# Altium schematic sheet 09 MMC_UBOOT.SchDoc
size 420 x 297 mm
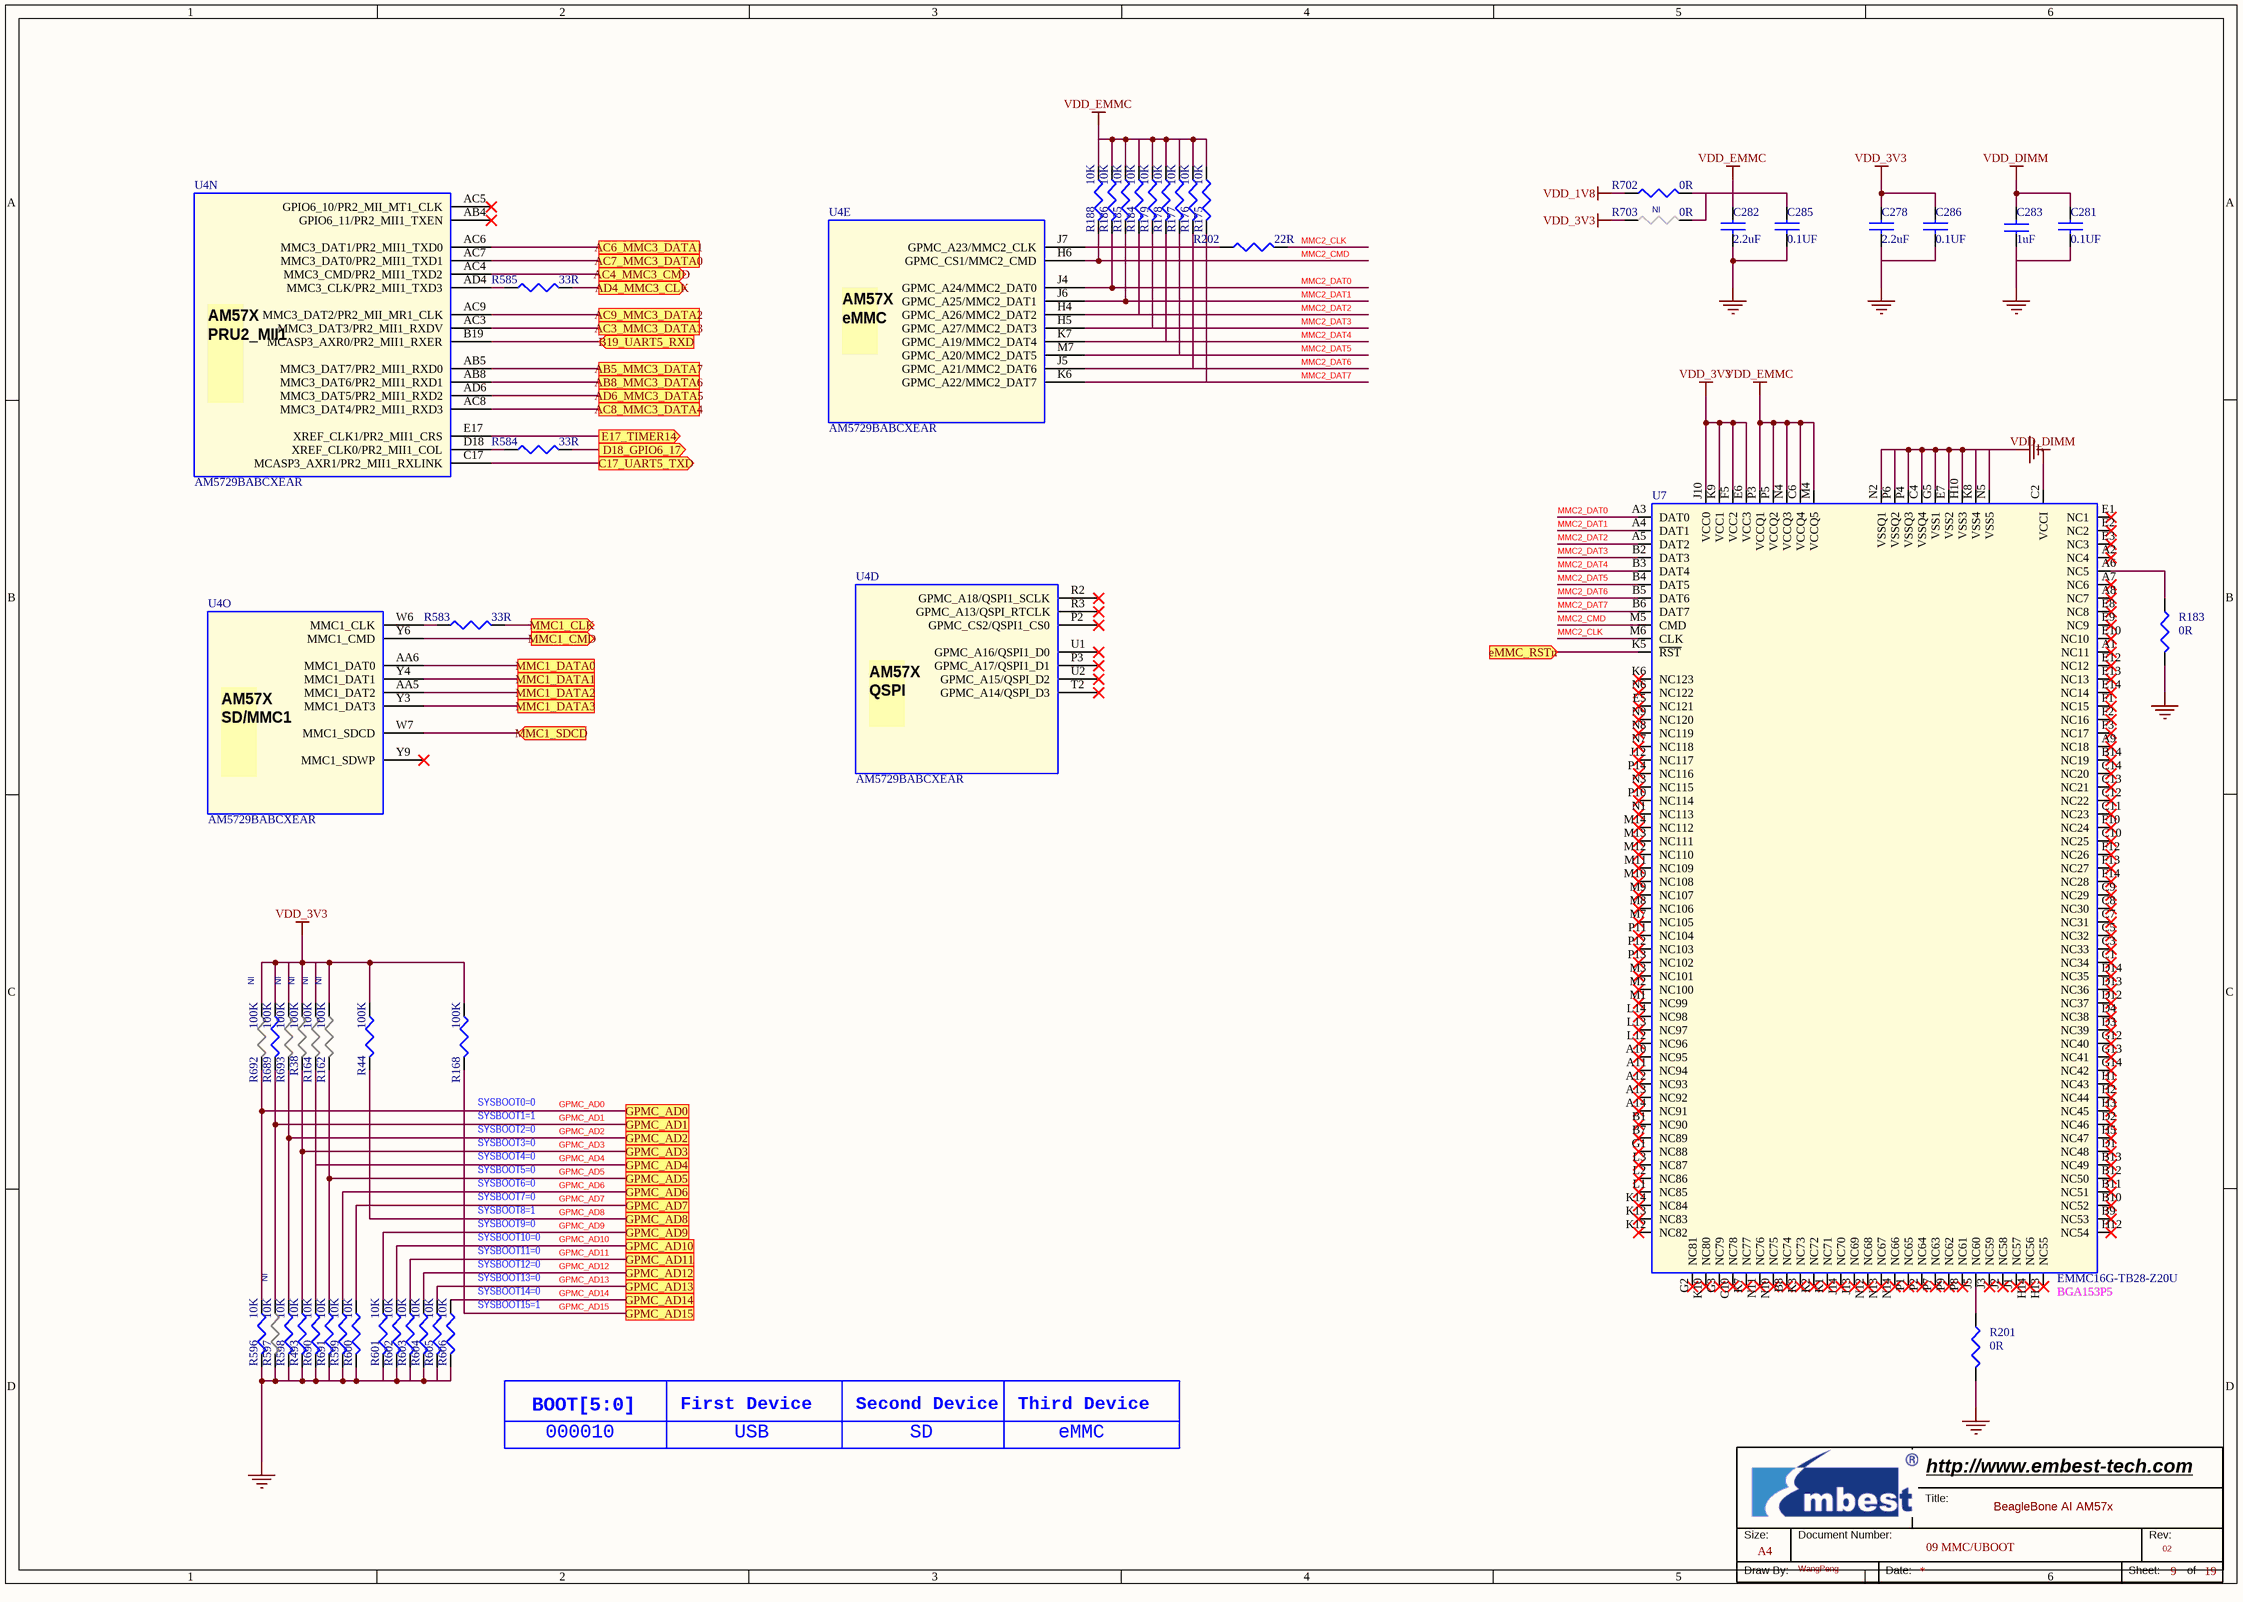
[diagram p0: 09 MMC_UBOOT.SchDoc]

## Parts
*  Page Count: 19  Page Number: 9  Page Size: A4  Title: BeagleBone AI AM57x  RevCode: 02  Doc: 09 MMC/UBOOT  Drawing: WangPeng  (hidden comment: Embest Title)  (graphical)
C278  2.2uF  [C0603]
C281  0.1UF  [C0402]
C282  2.2uF  [C0603]
C283  1uF  [C0402]
C285  0.1UF  [C0402]
C286  0.1UF  [C0402]
R38  100K  ASSY: NI  [R0402]
R44  100K  [R0402]
R162  100K  ASSY: NI  [R0402]
R164  100K  ASSY: NI  [R0402]
R168  100K  [R0402]
R175  10K  [R0402]
R176  10K  [R0402]
R177  10K  [R0402]
R178  10K  [R0402]
R179  10K  [R0402]
R183  0R  [R0402]
R184  10K  [R0402]
R185  10K  [R0402]
R186  10K  [R0402]
R188  10K  [R0402]
R201  0R  [R0402]
R202  22R  [R0402]
R493  10K  [R0402]
R583  33R  [R0402]
R584  33R  [R0402]
R585  33R  [R0402]
R596  10K  [R0402]
R597  10K  ASSY: NI  [R0402]
R598  10K  [R0402]
R599  10K  [R0402]
R600  10K  [R0402]
R601  10K  [R0402]
R602  10K  [R0402]
R603  10K  [R0402]
R604  10K  [R0402]
R605  10K  [R0402]
R606  10K  [R0402]
R689  100K  [R0402]
R690  10K  [R0402]
R691  10K  [R0402]
R692  100K  ASSY: NI  [R0402]
R693  100K  ASSY: NI  [R0402]
R702  0R  [R0402]
R703  0R  ASSY: NI  [R0402]
U4  AM5729BABCXEAR  [BGA23X23-760-117M]  (parts D,E,N,O of 29)
U7  EMMC16G-TB28-Z20U  [BGA153P5]

## Ports
AB5_MMC3_DATA7, AB8_MMC3_DATA6, AC3_MMC3_DATA3, AC4_MMC3_CMD (out), AC6_MMC3_DATA1, AC7_MMC3_DATA0, AC8_MMC3_DATA4, AC9_MMC3_DATA2, AD4_MMC3_CLK (out), AD6_MMC3_DATA5, B19_UART5_RXD (in), C17_UART5_TXD (out), D18_GPIO6_17 (out), E17_TIMER14 (out), eMMC_RSTn (in), GPMC_AD0, GPMC_AD1, GPMC_AD2, GPMC_AD3, GPMC_AD4, GPMC_AD5, GPMC_AD6, GPMC_AD7, GPMC_AD8, GPMC_AD9, GPMC_AD10, GPMC_AD11, GPMC_AD12, GPMC_AD13, GPMC_AD14, GPMC_AD15, MMC1_CLK (out), MMC1_CMD (out), MMC1_DATA0, MMC1_DATA1, MMC1_DATA2, MMC1_DATA3, MMC1_SDCD (in)

## Nets
GND: C278.2 C281.2 C282.2 C283.1 C285.2 C286.2 R183.2 R201.2 R493.2 R596.2 R597.2 R598.2 R599.2 R600.2 R601.2 R602.2 R603.2 R604.2 R605.2 R606.2 R690.2 R691.2 U7.C4(VSSQ4) U7.E7(VSS2) U7.G5(VSS1) U7.H10(VSS3) U7.K8(VSS4) U7.N2(VSSQ1) U7.N5(VSS5) U7.P4(VSSQ3) U7.P6(VSSQ2)
VDD_1V8: R702.1
VDD_3V3: C278.1 C286.1 R38.1 R44.1 R162.1 R164.1 R168.1 R689.1 R692.1 R693.1 R703.1 U7.E6(VCC3) U7.F5(VCC2) U7.J10(VCC0) U7.K9(VCC1)
VDD_DIMM: C281.1 C283.2 U7.C2(VCCI)
VDD_EMMC: C282.1 R175.1 R176.1 R177.1 R178.1 R179.1 R184.1 R185.1 R186.1 R188.1 U7.C6(VCCQ4) U7.M4(VCCQ5) U7.N4(VCCQ3) U7.P3(VCCQ1) U7.P5(VCCQ2)
AB5_MMC3_DATA7: U4.AB5(MMC3_DAT7/PR2_MII1_RXD0) ; port AB5_MMC3_DATA7
AB8_MMC3_DATA6: U4.AB8(MMC3_DAT6/PR2_MII1_RXD1) ; port AB8_MMC3_DATA6
AC3_MMC3_DATA3: U4.AC3(MMC3_DAT3/PR2_MII1_RXDV) ; port AC3_MMC3_DATA3
AC4_MMC3_CMD: U4.AC4(MMC3_CMD/PR2_MII1_TXD2) ; port AC4_MMC3_CMD
AC6_MMC3_DATA1: U4.AC6(MMC3_DAT1/PR2_MII1_TXD0) ; port AC6_MMC3_DATA1
AC7_MMC3_DATA0: U4.AC7(MMC3_DAT0/PR2_MII1_TXD1) ; port AC7_MMC3_DATA0
AC8_MMC3_DATA4: U4.AC8(MMC3_DAT4/PR2_MII1_RXD3) ; port AC8_MMC3_DATA4
AC9_MMC3_DATA2: U4.AC9(MMC3_DAT2/PR2_MII_MR1_CLK) ; port AC9_MMC3_DATA2
AD4_MMC3_CLK: R585.2 ; port AD4_MMC3_CLK
AD6_MMC3_DATA5: U4.AD6(MMC3_DAT5/PR2_MII1_RXD2) ; port AD6_MMC3_DATA5
B19_UART5_RXD: U4.B19(MCASP3_AXR0/PR2_MII1_RXER) ; port B19_UART5_RXD
C17_UART5_TXD: U4.C17(MCASP3_AXR1/PR2_MII1_RXLINK) ; port C17_UART5_TXD
D18_GPIO6_17: R584.2 ; port D18_GPIO6_17
E17_TIMER14: U4.E17(XREF_CLK1/PR2_MII1_CRS) ; port E17_TIMER14
eMMC_RSTn: U7.K5(~{RST}) ; port eMMC_RSTn
GPMC_AD0: R596.1 R692.2 ; port GPMC_AD0
GPMC_AD1: R597.1 R689.2 ; port GPMC_AD1
GPMC_AD2: R598.1 R693.2 ; port GPMC_AD2
GPMC_AD3: R38.2 R493.1 ; port GPMC_AD3
GPMC_AD4: R164.2 R690.1 ; port GPMC_AD4
GPMC_AD5: R162.2 R691.1 ; port GPMC_AD5
GPMC_AD6: R599.1 ; port GPMC_AD6
GPMC_AD7: R600.1 ; port GPMC_AD7
GPMC_AD8: R44.2 ; port GPMC_AD8
GPMC_AD9: R601.1 ; port GPMC_AD9
GPMC_AD10: R602.1 ; port GPMC_AD10
GPMC_AD11: R603.1 ; port GPMC_AD11
GPMC_AD12: R604.1 ; port GPMC_AD12
GPMC_AD13: R605.1 ; port GPMC_AD13
GPMC_AD14: R606.1 ; port GPMC_AD14
GPMC_AD15: R168.2 ; port GPMC_AD15
MMC1_CLK: R583.2 ; port MMC1_CLK
MMC1_CMD: U4.Y6(MMC1_CMD) ; port MMC1_CMD
MMC1_DATA0: U4.AA6(MMC1_DAT0) ; port MMC1_DATA0
MMC1_DATA1: U4.Y4(MMC1_DAT1) ; port MMC1_DATA1
MMC1_DATA2: U4.AA5(MMC1_DAT2) ; port MMC1_DATA2
MMC1_DATA3: U4.Y3(MMC1_DAT3) ; port MMC1_DATA3
MMC1_SDCD: U4.W7(MMC1_SDCD) ; port MMC1_SDCD
MMC2_CLK: R202.2 U7.M6(CLK)
MMC2_CMD: R188.2 U4.H6(GPMC_CS1/MMC2_CMD) U7.M5(CMD)
MMC2_DAT0: R186.2 U4.J4(GPMC_A24/MMC2_DAT0) U7.A3(DAT0)
MMC2_DAT1: R185.2 U4.J6(GPMC_A25/MMC2_DAT1) U7.A4(DAT1)
MMC2_DAT2: R184.2 U4.H4(GPMC_A26/MMC2_DAT2) U7.A5(DAT2)
MMC2_DAT3: R179.2 U4.H5(GPMC_A27/MMC2_DAT3) U7.B2(DAT3)
MMC2_DAT4: R178.2 U4.K7(GPMC_A19/MMC2_DAT4) U7.B3(DAT4)
MMC2_DAT5: R177.2 U4.M7(GPMC_A20/MMC2_DAT5) U7.B4(DAT5)
MMC2_DAT6: R176.2 U4.J5(GPMC_A21/MMC2_DAT6) U7.B5(DAT6)
MMC2_DAT7: R175.2 U4.K6(GPMC_A22/MMC2_DAT7) U7.B6(DAT7)
NetC285_1: C285.1 R702.2 R703.2
NetR183_1: R183.1 U7.A6(NC5)
NetR201_1: R201.1 U7.J5(NC60)
NetR202_1: R202.1 U4.J7(GPMC_A23/MMC2_CLK)
NetR583_1: R583.1 U4.W6(MMC1_CLK)
NetR584_1: R584.1 U4.D18(XREF_CLK0/PR2_MII1_COL)
NetR585_1: R585.1 U4.AD4(MMC3_CLK/PR2_MII1_TXD3)

Not connected (* = marked no-connect by the designer): U4 AB4(GPIO6_11/PR2_MII1_TXEN)* AC5(GPIO6_10/PR2_MII_MT1_CLK)* P2(GPMC_CS2/QSPI1_CS0)* P3(GPMC_A17/QSPI1_D1)* R2(GPMC_A18/QSPI1_SCLK)* R3(GPMC_A13/QSPI_RTCLK)* T2(GPMC_A14/QSPI_D3)* U1(GPMC_A16/QSPI1_D0)* U2(GPMC_A15/QSPI_D2)* Y9(MMC1_SDWP)*; U7 A1(NC11)* A2(NC4)* A7(NC6)* A8(NC7)* A9(NC18)* A10(NC95)* A11(NC94)* A12(NC93)* A13(NC92)* A14(NC91)* B1(NC90)* B7(NC89)* B8(NC74)* B9(NC53)* B10(NC52)* B11(NC51)* B12(NC50)* B13(NC49)* B14(NC19)* C1(NC34)* C3(NC33)* C5(NC32)* C7(NC31)* C8(NC30)* C9(NC29)* C10(NC25)* C11(NC23)* C12(NC22)* C13(NC21)* C14(NC20)* D1(NC48)* D2(NC46)* D3(NC39)* D4(NC38)* D12(NC37)* D13(NC36)* D14(NC35)* E1(NC1)* E2(NC2)* E3(NC3)* E5(NC121)* E8(NC8)* E9(NC9)* E10(NC10)* E12(NC12)* E13(NC13)* E14(NC14)* F1(NC15)* F2(NC16)* F3(NC17)* F10(NC24)* F12(NC26)* F13(NC27)* F14(NC28)* G1(NC88)* G2(NC81)* G3(NC79)* G10(NC78)* G12(NC40)* G13(NC41)* G14(NC42)* H1(NC43)* H2(NC44)* H3(NC45)* H5(NC47)* H12(NC54)* H13(NC55)* H14(NC56)* J1(NC57)* J2(NC58)* J3(NC59)* J12(NC117)* J13(NC69)* J14(NC70)* K1(NC71)* K2(NC72)* K3(NC73)* K6(NC123)* K7(NC77)* K10(NC80)* K12(NC82)* K13(NC83)* K14(NC84)* L1(NC85)* L2(NC86)* L3(NC87)* L12(NC96)* L13(NC97)* L14(NC98)* M1(NC99)* M2(NC100)* M3(NC101)* M7(NC105)* M8(NC106)* M9(NC107)* M10(NC108)* M11(NC109)* M12(NC110)* M13(NC111)* M14(NC112)* N1(NC113)* N3(NC115)* N6(NC122)* N7(NC118)* N8(NC119)* N9(NC120)* N10(NC75)* N11(NC76)* N12(NC68)* N13(NC67)* N14(NC66)* P1(NC65)* P2(NC64)* P7(NC63)* P8(NC61)* P9(NC62)* P10(NC114)* P11(NC104)* P12(NC103)* P13(NC102)* P14(NC116)*

## Notes on the sheet
- (near R168) SYSBOOT0=0
- SYSBOOT1=1
- SYSBOOT2=0
- SYSBOOT3=0
- SYSBOOT4=0
- SYSBOOT5=0
- SYSBOOT6=0
- SYSBOOT7=0
- SYSBOOT8=1
- SYSBOOT9=0
- SYSBOOT10=0
- SYSBOOT11=0
- SYSBOOT12=0
- SYSBOOT13=0
- SYSBOOT14=0
- SYSBOOT15=1
- BOOT[5:0]
- 000010
- First Device
- USB
- Second Device
- SD
- Third Device
- eMMC
- (in symbol AM57X, part D) AM57X / QSPI /
- (in symbol AM57X, part E) AM57X / eMMC /
- (in symbol AM57X, part N) AM57X / PRU2_MII1 /
- (in symbol AM57X, part O) AM57X / SD/MMC1 /
- (in symbol Embest Title) Title:; Size:; Document Number:; Rev:; Draw By:; Date:; Sheet:; of

## Library data of the parts
C278 = C: CAP,2.2UF,+/-10%,X5R,16V,SMD0603; Manufacturer: Murata; Manufacturer Part Number: GRM188R61C225KE15D; Embest PN: 1004001100124; Part Type: Ceramic Capacitor
C281 C286 = C: CAP,100NF,+/-10%,X7R,16V,SMD0402; Manufacturer Part Number: GRM155R71C104KA88D; Manufacturer: Murata; Embest PN: 1004001100047; Datasheet: Y:\ÐÂK3ÏµÍ³ÎïÁÏdatasheet\[1003_1004]capacitor-resistor µçÈÝ¡¢µç×è\1004001100047-GRM155R71C104KA88D.pdf; Part Type: Ceramic Capacitor
C282 = C: CAP,2.2UF,+/-10%,X5R,16V,SMD0603; Manufacturer Part Number: GRM188R61C225KE15D; Manufacturer: Murata; Embest PN: 1004001100124; Part Type: Ceramic Capacitor
C283 = C: CAP,1UF,+/-10%,X5R,10V,SMD0402; Manufacturer Part Number: GRM155R61A105KE15D; Manufacturer: Murata; Embest PN: 1004001100057; Part Type: Ceramic Capacitor
C285 = C: CAP,100NF,+/-10%,X7R,16V,SMD0402; Manufacturer: Murata; Manufacturer Part Number: GRM155R71C104KA88D; Embest PN: 1004001100047; Part Type: Ceramic Capacitor; Datasheet: Y:\ÐÂK3ÏµÍ³ÎïÁÏdatasheet\[1003_1004]capacitor-resistor µçÈÝ¡¢µç×è\1004001100047-GRM155R71C104KA88D.pdf
R38 R44 R162 R692 = R: RES,100K,+/-5%,1/16W,SMD0402; Manufacturer: YAGEO; Manufacturer Part Number: RC0402JR-07100KL; Embest PN: 1003001100119; Part Type: Thick film Resistor
R164 R168 R689 R693 = R: RES,100K,+/-5%,1/16W,SMD0402; Manufacturer Part Number: RC0402JR-07100KL; Manufacturer: YAGEO; Embest PN: 1003001100119; Part Type: Thick film Resistor
R175 R177 R179 R185 R493 R599 R601 R603 R605 R691 = R: RES,10K,+/-5%,1/16W,SMD0402; Manufacturer Part Number: RC0402JR-0710KL; Manufacturer: YAGEO; Embest PN: 1003001100072; Part Type: Thick film Resistor
R176 R178 R184 R186 R188 R596-R598 R600 R602 R604 R606 R690 = R: RES,10K,+/-5%,1/16W,SMD0402; Manufacturer: YAGEO; Manufacturer Part Number: RC0402JR-0710KL; Embest PN: 1003001100072; Part Type: Thick film Resistor
R183 R201 R702 = R: RES,0R,+/-5%,1/16W,SMD0402; Manufacturer: YAGEO; Manufacturer Part Number: RC0402JR-070RL; Embest PN: 1003001100001; Part Type: Thick film Resistor
R202 = R: RES,22R,+/-5%,1/16W,SMD0402; Manufacturer: YAGEO; Manufacturer Part Number: RC0402JR-0722RL; Embest PN: 1003001100007; Part Type: Thick film Resistor
R583-R585 = R: RES,33R,+/-5%,1/16W,SMD0402; Manufacturer Part Number: RC0402JR-0733RL; Manufacturer: YAGEO; Embest PN: 1003001100010; Part Type: Thick film Resistor
R703 = R: RES,0R,+/-5%,1/16W,SMD0402; Manufacturer Part Number: RC0402JR-070RL; Manufacturer: YAGEO; Embest PN: 1003001100001; Part Type: Thick film Resistor
U4 = AM57X: IC ARM Dual Cortex-A15 Microprocessor FCBGA(ABC)-760 SMD JEDEC TRAY; Vendor: TI; Embest PN: 1002001100053; Part Type: MPU; Manufacturer: TI; Manufacturer Part Number: AM5729BABCXEAR; Status: BeagleBone AI
U7 = EMMC08G-W325-X01: IC,Memory,16GB,EMMC,EMMC16G-TB28-Z20U,FBGA153,SMD; Manufacturer: Kingston; Embest PN: 1002003100376; PCB Footprint: BGA153P5; Part Type: Memory; Manufacturer Part Number: EMMC16G-TB28-Z20U; Status: BeagleBone AI
* = Embest Title: Page Create Date: May 29, 2006; WebSite: http://www.embest-tech.com; Company: Embest; Page Modify Date: *